# EAGLE design discharger (EAGLE 9.6.2)
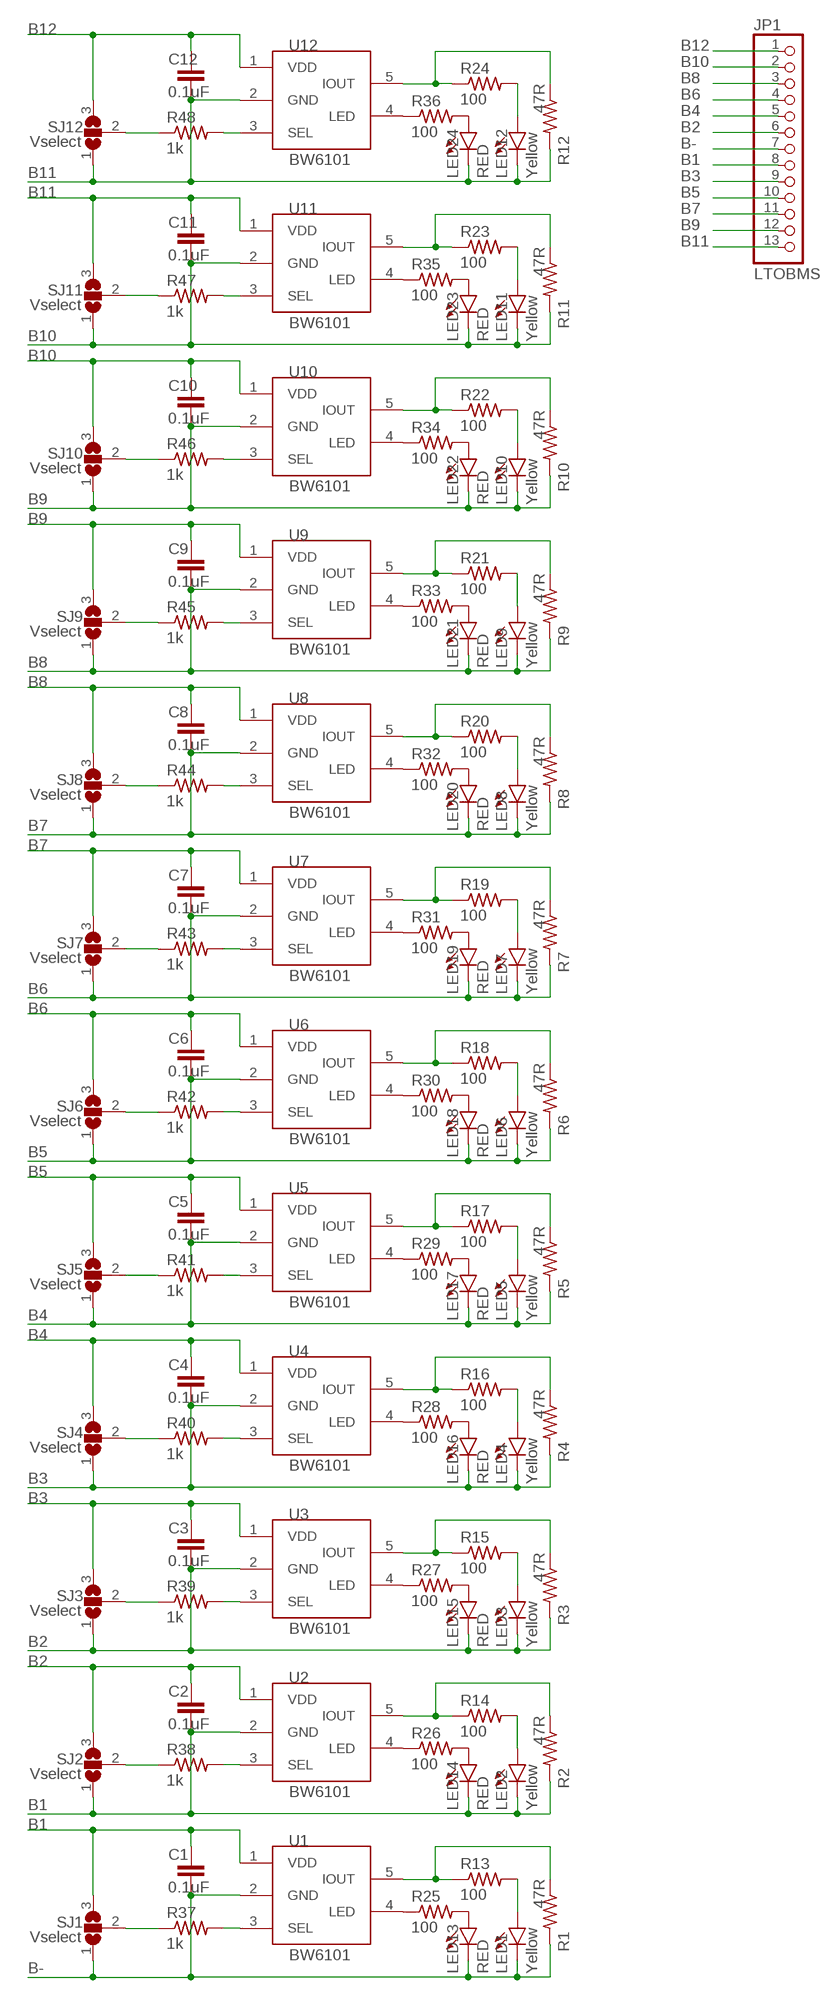
[diagram p0: schematic, sheet 1]

## Parts
C1  0.1uF  C-EUC0603  [C0603]
C2  0.1uF  C-EUC0603  [C0603]
C3  0.1uF  C-EUC0603  [C0603]
C4  0.1uF  C-EUC0603  [C0603]
C5  0.1uF  C-EUC0603  [C0603]
C6  0.1uF  C-EUC0603  [C0603]
C7  0.1uF  C-EUC0603  [C0603]
C8  0.1uF  C-EUC0603  [C0603]
C9  0.1uF  C-EUC0603  [C0603]
C10  0.1uF  C-EUC0603  [C0603]
C11  0.1uF  C-EUC0603  [C0603]
C12  0.1uF  C-EUC0603  [C0603]
JP1  LTOBMS  PINHD-1X13  [1X13]
LED1  Yellow  LED-YELLOW0603  [LED-0603]
LED2  Yellow  LED-YELLOW0603  [LED-0603]
LED3  Yellow  LED-YELLOW0603  [LED-0603]
LED4  Yellow  LED-YELLOW0603  [LED-0603]
LED5  Yellow  LED-YELLOW0603  [LED-0603]
LED6  Yellow  LED-YELLOW0603  [LED-0603]
LED7  Yellow  LED-YELLOW0603  [LED-0603]
LED8  Yellow  LED-YELLOW0603  [LED-0603]
LED9  Yellow  LED-YELLOW0603  [LED-0603]
LED10  Yellow  LED-YELLOW0603  [LED-0603]
LED11  Yellow  LED-YELLOW0603  [LED-0603]
LED12  Yellow  LED-YELLOW0603  [LED-0603]
LED13  RED  LED-RED0603  [LED-0603]
LED14  RED  LED-RED0603  [LED-0603]
LED15  RED  LED-RED0603  [LED-0603]
LED16  RED  LED-RED0603  [LED-0603]
LED17  RED  LED-RED0603  [LED-0603]
LED18  RED  LED-RED0603  [LED-0603]
LED19  RED  LED-RED0603  [LED-0603]
LED20  RED  LED-RED0603  [LED-0603]
LED21  RED  LED-RED0603  [LED-0603]
LED22  RED  LED-RED0603  [LED-0603]
LED23  RED  LED-RED0603  [LED-0603]
LED24  RED  LED-RED0603  [LED-0603]
R1  47R  R-US_R2512  [R2512]
R2  47R  R-US_R2512  [R2512]
R3  47R  R-US_R2512  [R2512]
R4  47R  R-US_R2512  [R2512]
R5  47R  R-US_R2512  [R2512]
R6  47R  R-US_R2512  [R2512]
R7  47R  R-US_R2512  [R2512]
R8  47R  R-US_R2512  [R2512]
R9  47R  R-US_R2512  [R2512]
R10  47R  R-US_R2512  [R2512]
R11  47R  R-US_R2512  [R2512]
R12  47R  R-US_R2512  [R2512]
R13  100  R-US_R0603  [R0603]
R14  100  R-US_R0603  [R0603]
R15  100  R-US_R0603  [R0603]
R16  100  R-US_R0603  [R0603]
R17  100  R-US_R0603  [R0603]
R18  100  R-US_R0603  [R0603]
R19  100  R-US_R0603  [R0603]
R20  100  R-US_R0603  [R0603]
R21  100  R-US_R0603  [R0603]
R22  100  R-US_R0603  [R0603]
R23  100  R-US_R0603  [R0603]
R24  100  R-US_R0603  [R0603]
R25  100  R-US_R0603  [R0603]
R26  100  R-US_R0603  [R0603]
R27  100  R-US_R0603  [R0603]
R28  100  R-US_R0603  [R0603]
R29  100  R-US_R0603  [R0603]
R30  100  R-US_R0603  [R0603]
R31  100  R-US_R0603  [R0603]
R32  100  R-US_R0603  [R0603]
R33  100  R-US_R0603  [R0603]
R34  100  R-US_R0603  [R0603]
R35  100  R-US_R0603  [R0603]
R36  100  R-US_R0603  [R0603]
R37  1k  R-US_R0603  [R0603]
R38  1k  R-US_R0603  [R0603]
R39  1k  R-US_R0603  [R0603]
R40  1k  R-US_R0603  [R0603]
R41  1k  R-US_R0603  [R0603]
R42  1k  R-US_R0603  [R0603]
R43  1k  R-US_R0603  [R0603]
R44  1k  R-US_R0603  [R0603]
R45  1k  R-US_R0603  [R0603]
R46  1k  R-US_R0603  [R0603]
R47  1k  R-US_R0603  [R0603]
R48  1k  R-US_R0603  [R0603]
SJ1  Vselect  SJ2W  [SJ_2]
SJ2  Vselect  SJ2W  [SJ_2]
SJ3  Vselect  SJ2W  [SJ_2]
SJ4  Vselect  SJ2W  [SJ_2]
SJ5  Vselect  SJ2W  [SJ_2]
SJ6  Vselect  SJ2W  [SJ_2]
SJ7  Vselect  SJ2W  [SJ_2]
SJ8  Vselect  SJ2W  [SJ_2]
SJ9  Vselect  SJ2W  [SJ_2]
SJ10  Vselect  SJ2W  [SJ_2]
SJ11  Vselect  SJ2W  [SJ_2]
SJ12  Vselect  SJ2W  [SJ_2]
U1  BW6101  [SOT23-5L]
U2  BW6101  [SOT23-5L]
U3  BW6101  [SOT23-5L]
U4  BW6101  [SOT23-5L]
U5  BW6101  [SOT23-5L]
U6  BW6101  [SOT23-5L]
U7  BW6101  [SOT23-5L]
U8  BW6101  [SOT23-5L]
U9  BW6101  [SOT23-5L]
U10  BW6101  [SOT23-5L]
U11  BW6101  [SOT23-5L]
U12  BW6101  [SOT23-5L]

## Nets
B1: C1.1 C2.2 JP1.8 LED2.C LED14.C R2.2 SJ1.3 SJ2.1 U1.1(VDD) U2.2(GND)
B2: C2.1 C3.2 JP1.6 LED3.C LED15.C R3.2 SJ2.3 SJ3.1 U2.1(VDD) U3.2(GND)
B3: C3.1 C4.2 JP1.9 LED4.C LED16.C R4.2 SJ3.3 SJ4.1 U3.1(VDD) U4.2(GND)
B4: C4.1 C5.2 JP1.5 LED5.C LED17.C R5.2 SJ4.3 SJ5.1 U4.1(VDD) U5.2(GND)
B5: C5.1 C6.2 JP1.10 LED6.C LED18.C R6.2 SJ5.3 SJ6.1 U5.1(VDD) U6.2(GND)
B6: C6.1 C7.2 JP1.4 LED7.C LED19.C R7.2 SJ6.3 SJ7.1 U6.1(VDD) U7.2(GND)
B7: C7.1 C8.2 JP1.11 LED8.C LED20.C R8.2 SJ7.3 SJ8.1 U7.1(VDD) U8.2(GND)
B8: C8.1 C9.2 JP1.3 LED9.C LED21.C R9.2 SJ8.3 SJ9.1 U8.1(VDD) U9.2(GND)
B9: C9.1 C10.2 JP1.12 LED10.C LED22.C R10.2 SJ9.3 SJ10.1 U9.1(VDD) U10.2(GND)
B10: C10.1 C11.2 JP1.2 LED11.C LED23.C R11.2 SJ10.3 SJ11.1 U10.1(VDD) U11.2(GND)
B11: C11.1 C12.2 JP1.13 LED12.C LED24.C R12.2 SJ11.3 SJ12.1 U11.1(VDD) U12.2(GND)
B12: C12.1 JP1.1 SJ12.3 U12.1(VDD)
B-: C1.2 JP1.7 LED1.C LED13.C R1.2 SJ1.1 U1.2(GND)
N$1: R1.1 R13.1 U1.5(IOUT)
N$2: LED1.A R13.2
N$3: R25.1 U1.4(LED)
N$4: LED2.A R14.2
N$5: LED7.A R19.2
N$6: R3.1 R15.1 U3.5(IOUT)
N$7: R37.1 SJ1.2
N$8: R38.1 SJ2.2
N$9: R27.1 U3.4(LED)
N$10: LED15.A R27.2
N$11: LED8.A R20.2
N$12: R39.1 SJ3.2
N$13: R40.1 SJ4.2
N$14: LED9.A R21.2
N$15: LED13.A R25.2
N$16: R8.1 R20.1 U8.5(IOUT)
N$17: R41.1 SJ5.2
N$18: R42.1 SJ6.2
N$19: R32.1 U8.4(LED)
N$20: LED20.A R32.2
N$21: R2.1 R14.1 U2.5(IOUT)
N$22: R43.1 SJ7.2
N$23: R44.1 SJ8.2
N$24: R26.1 U2.4(LED)
N$25: LED14.A R26.2
N$26: R4.1 R16.1 U4.5(IOUT)
N$27: R45.1 SJ9.2
N$28: R46.1 SJ10.2
N$29: R28.1 U4.4(LED)
N$30: LED16.A R28.2
N$31: LED10.A R22.2
N$32: LED11.A R23.2
N$33: LED12.A R24.2
N$34: LED6.A R18.2
N$35: LED5.A R17.2
N$36: R5.1 R17.1 U5.5(IOUT)
N$37: R47.1 SJ11.2
N$38: R48.1 SJ12.2
N$39: R29.1 U5.4(LED)
N$40: LED17.A R29.2
N$41: R9.1 R21.1 U9.5(IOUT)
N$42: R48.2 U12.3(SEL)
N$43: R47.2 U11.3(SEL)
N$44: R33.1 U9.4(LED)
N$45: LED21.A R33.2
N$46: R6.1 R18.1 U6.5(IOUT)
N$47: R46.2 U10.3(SEL)
N$48: R45.2 U9.3(SEL)
N$49: R30.1 U6.4(LED)
N$50: LED18.A R30.2
N$51: LED4.A R16.2
N$52: LED3.A R15.2
N$53: R44.2 U8.3(SEL)
N$54: R43.2 U7.3(SEL)
N$55: R42.2 U6.3(SEL)
N$56: R7.1 R19.1 U7.5(IOUT)
N$57: R41.2 U5.3(SEL)
N$58: R40.2 U4.3(SEL)
N$59: R31.1 U7.4(LED)
N$60: LED19.A R31.2
N$61: R10.1 R22.1 U10.5(IOUT)
N$62: R39.2 U3.3(SEL)
N$63: R38.2 U2.3(SEL)
N$64: R34.1 U10.4(LED)
N$65: LED22.A R34.2
N$66: R37.2 U1.3(SEL)
N$71: R11.1 R23.1 U11.5(IOUT)
N$74: R35.1 U11.4(LED)
N$75: LED23.A R35.2
N$81: R12.1 R24.1 U12.5(IOUT)
N$84: R36.1 U12.4(LED)
N$85: LED24.A R36.2

## Library data of the parts
C1-C12 = resistor:C-EU: CAPACITOR, European symbol; LCSCPART#: C49678
JP1 = pinhead:PINHD-1X13: PIN HEADER
LED1-LED12 = ltobms:LED-YELLOW: Yellow SMD LED Used in manufacturing several products at SparkFun. Packages: 0603 - SMD 0603 package[Product Link] <http://www.kingbrightusa.com/product.asp?catalog_name=LED&product_id=APT1608SYCK> 0603 -SMART - SMART SMD 0603 package (more efficient/more expensive) [Product Link] <http://www.osram-os.com/osram_os/en/products/product-catalog/led-light-emitting-diodes/smartled-0603/ly-l29k/index.jsp> LilyPad - SMD1206 package[Product Datasheet] <https://www.sparkfun.com/datasheets/DevTools/LilyPad/Q150YUS4.pdf> SparkFun Products: Blynk Board <https://www.sparkfun.com/products/13794> IOIO-OTG <https://www.sparkfun.com/products/13613> XBee Explorer Serial <https://www.sparkfun.com/products/13225>; LCSCPART#: C84256; PROD_ID: DIO-09003
LED13-LED24 = ltobms:LED-RED: Red SMD LED Used in manufacturing of most products at SparkFun Packages: 0603 - SMD 0603 package [Product Link] <http://docs.avagotech.com/docs/AV02-0551EN> 0603 SMART - SMD 0603 SMART package ( more efficient and expensive)[Product Link] <http://www.osram-os.com/Graphics/XPic2/00077099_0.pdf> 1206 - SMD1206 package [Product Link] <https://www.sparkfun.com/datasheets/DevTools/LilyPad/Q150OVS4.pdff> SparkFun Products: Pro Mini 328 -5V <https://www.sparkfun.com/products/821> RedBoard <https://www.sparkfun.com/products/12757> IOIO-OTG <https://www.sparkfun.com/products/13613>; LCSCPART#: C84256; PROD_ID: DIO-00819
R1-R12 = resistor:R-US_: RESISTOR, American symbol; LCSCPART#: C25384
R13-R36 = resistor:R-US_: RESISTOR, American symbol; LCSCPART#: C17408
R37-R48 = resistor:R-US_: RESISTOR, American symbol; LCSCPART#: C17513
SJ1-SJ12 = jumper:SJ2W: SMD solder JUMPER
U1-U12 = ltobms:BW6101: Super capacitor charging protection chip

## Net classes
0 default: width 0.305 mm, clearance 0.229 mm

## Board
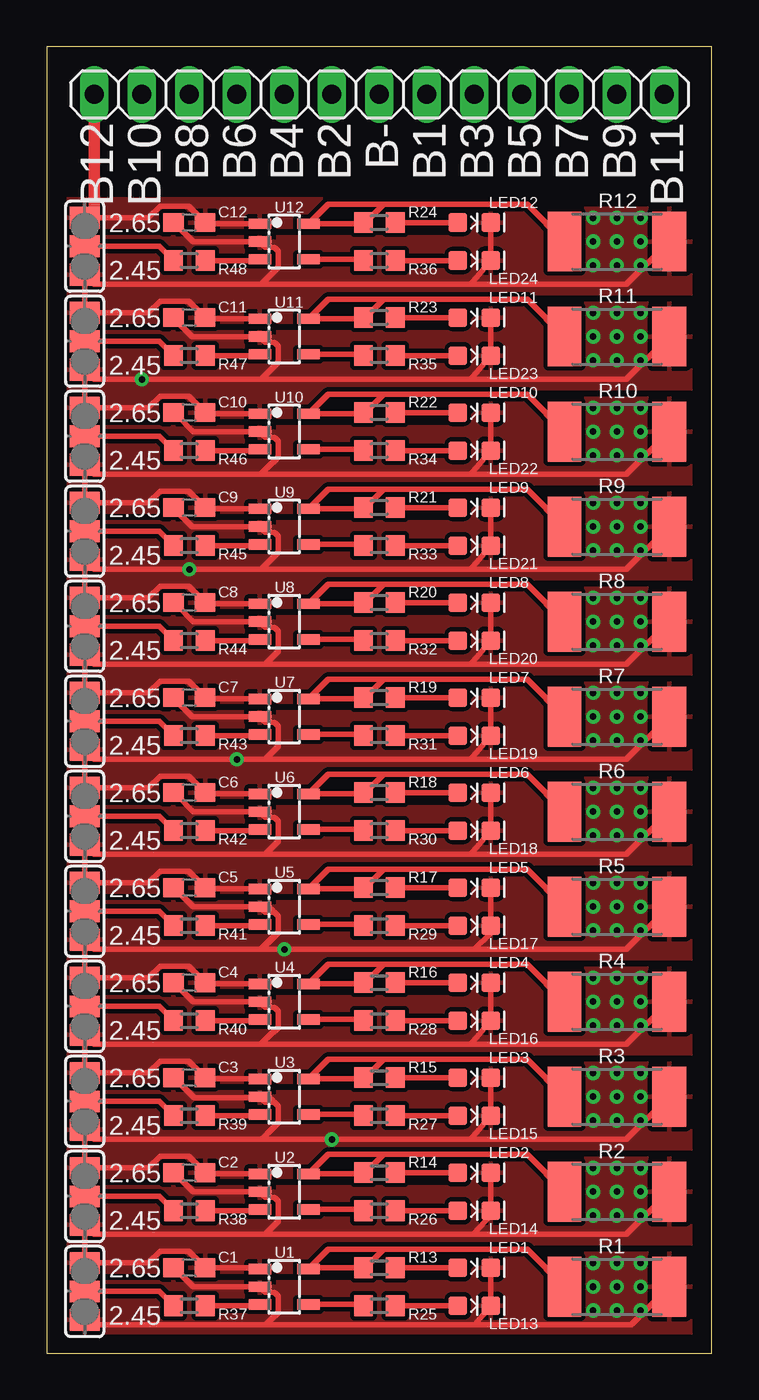
[diagram p1: board, top side]
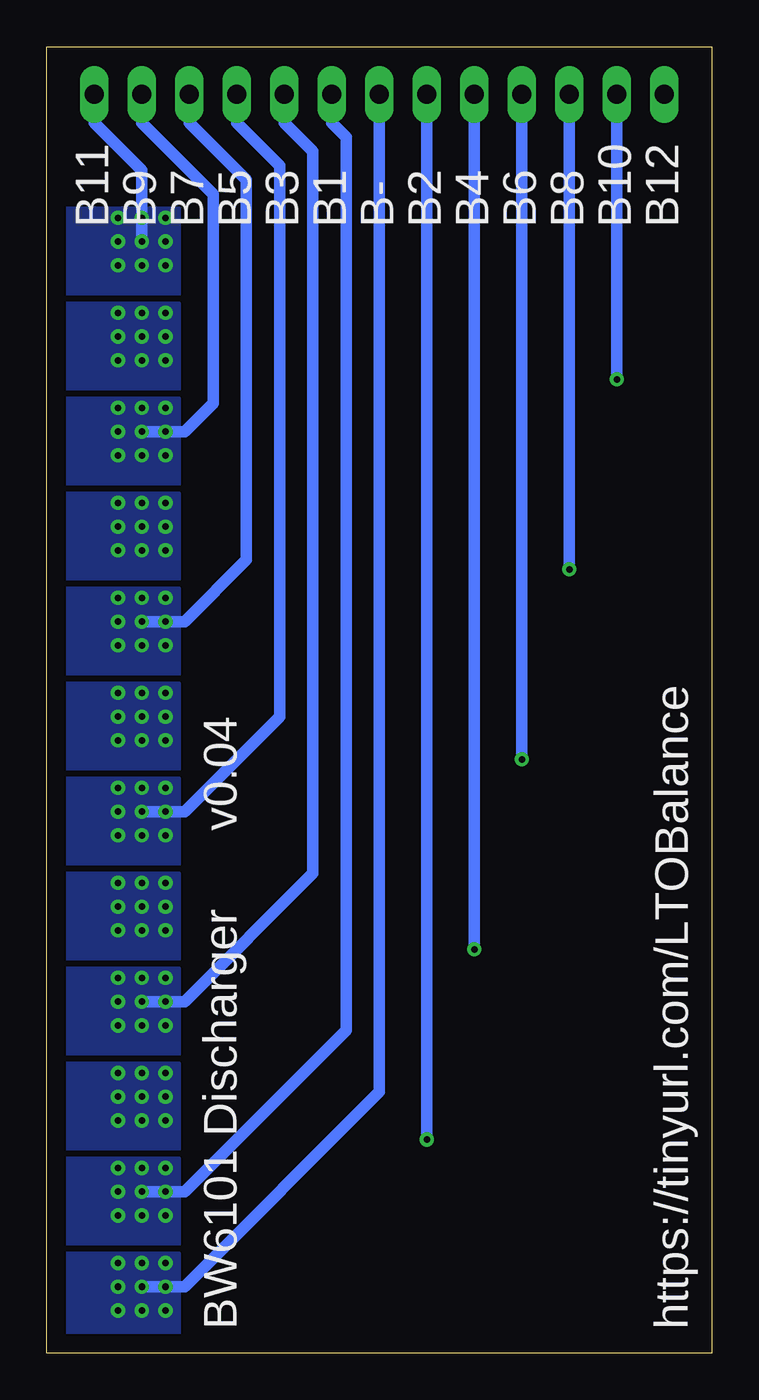
[diagram p2: board, bottom side, seen from below]

Size 35.56 x 69.85 mm. Coordinates in mm from the lower left corner, seen from the top.
Outline: 0,0 35.56,0 35.56,69.85 0,69.85 0,0
Copper layers (1*16): Top 0.035mm / dielectric 1.5mm / Bottom 0.035mm
Design rules "default *": minimum track width 6mil, minimum drill 0.35mm, track to track 6mil, track to pad 6mil, pad to pad 6mil, via to via 6mil, smd to smd 6mil, copper to edge 40mil, drill to drill 6mil, minimum pad ring 10mil, minimum via ring 8mil, stop-mask expansion 4mil, vias tented up to drill 14mil, thermal gap 10mil

### Footprints (pad centres in the part's own frame; a part is rotated, then mirrored left to right if it is on the bottom)
C0603 = smd 1.1 x 1: 1 -0.85,0; 2 0.85,0
1X13 = drill 1.016 long: 1 -15.24,0; 2 -12.7,0; 3 -10.16,0; 4 -7.62,0; 5 -5.08,0; 6 -2.54,0; 7 0,0; 8 2.54,0; 9 5.08,0; 10 7.62,0; 11 10.16,0; 12 12.7,0; 13 15.24,0
LED-0603 = smd 1 x 1: A -0.877,0; C 0.877,0
R2512 = smd 1.8 x 3.2: 1 -2.8,0; 2 2.8,0
R0603 = smd 1 x 1.1: 1 -0.85,0; 2 0.85,0
SJ_2 = smd 1.168 x 1.6: 1 -1.524,0; 2 0,0; 3 1.524,0
SOT23-5L = smd 0.55 x 1.2: 1 -0.95,-1.3; 2 0,-1.3; 3 0.95,-1.3; 4 0.95,1.3; 5 -0.95,1.3

### Placement (x,y rotation side)
C1  7.62,4.57 180 top
C2  7.62,9.65 180 top
C3  7.62,14.73 180 top
C4  7.62,19.81 180 top
C5  7.62,24.89 180 top
C6  7.62,29.97 180 top
C7  7.62,35.05 180 top
C8  7.62,40.13 180 top
C9  7.62,45.21 180 top
C10  7.62,50.29 180 top
C11  7.62,55.37 180 top
C12  7.62,60.45 180 top
JP1  17.78,67.31 0 top
LED1  22.86,4.57 0 top
LED2  22.86,9.65 0 top
LED3  22.86,14.73 0 top
LED4  22.86,19.81 0 top
LED5  22.86,24.89 0 top
LED6  22.86,29.97 0 top
LED7  22.86,35.05 0 top
LED8  22.86,40.13 0 top
LED9  22.86,45.21 0 top
LED10  22.86,50.29 0 top
LED11  22.86,55.37 0 top
LED12  22.86,60.45 0 top
LED13  22.86,2.54 0 top
LED14  22.86,7.62 0 top
LED15  22.86,12.7 0 top
LED16  22.86,17.78 0 top
LED17  22.86,22.86 0 top
LED18  22.86,27.94 0 top
LED19  22.86,33.02 0 top
LED20  22.86,38.1 0 top
LED21  22.86,43.18 0 top
LED22  22.86,48.26 0 top
LED23  22.86,53.34 0 top
LED24  22.86,58.42 0 top
R1  30.48,3.56 0 top
R2  30.48,8.64 0 top
R3  30.48,13.72 0 top
R4  30.48,18.8 0 top
R5  30.48,23.88 0 top
R6  30.48,28.96 0 top
R7  30.48,34.04 0 top
R8  30.48,39.12 0 top
R9  30.48,44.2 0 top
R10  30.48,49.28 0 top
R11  30.48,54.36 0 top
R12  30.48,59.44 0 top
R13  17.78,4.57 0 top
R14  17.78,9.65 0 top
R15  17.78,14.73 0 top
R16  17.78,19.81 0 top
R17  17.78,24.89 0 top
R18  17.78,29.97 0 top
R19  17.78,35.05 0 top
R20  17.78,40.13 0 top
R21  17.78,45.21 0 top
R22  17.78,50.29 0 top
R23  17.78,55.37 0 top
R24  17.78,60.45 0 top
R25  17.78,2.54 0 top
R26  17.78,7.62 0 top
R27  17.78,12.7 0 top
R28  17.78,17.78 0 top
R29  17.78,22.86 0 top
R30  17.78,27.94 0 top
R31  17.78,33.02 0 top
R32  17.78,38.1 0 top
R33  17.78,43.18 0 top
R34  17.78,48.26 0 top
R35  17.78,53.34 0 top
R36  17.78,58.42 0 top
R37  7.62,2.54 0 top
R38  7.62,7.62 0 top
R39  7.62,12.7 0 top
R40  7.62,17.78 0 top
R41  7.62,22.86 0 top
R42  7.62,27.94 0 top
R43  7.62,33.02 0 top
R44  7.62,38.1 0 top
R45  7.62,43.18 0 top
R46  7.62,48.26 0 top
R47  7.62,53.34 0 top
R48  7.62,58.42 0 top
SJ1  2.03,3.3 90 top
SJ2  2.03,8.38 90 top
SJ3  2.03,13.46 90 top
SJ4  2.03,18.54 90 top
SJ5  2.03,23.62 90 top
SJ6  2.03,28.7 90 top
SJ7  2.03,33.78 90 top
SJ8  2.03,38.86 90 top
SJ9  2.03,43.94 90 top
SJ10  2.03,49.02 90 top
SJ11  2.03,54.1 90 top
SJ12  2.03,59.18 90 top
U1  12.7,3.56 270 top
U2  12.7,8.64 270 top
U3  12.7,13.72 270 top
U4  12.7,18.8 270 top
U5  12.7,23.88 270 top
U6  12.7,28.96 270 top
U7  12.7,34.04 270 top
U8  12.7,39.12 270 top
U9  12.7,44.2 270 top
U10  12.7,49.28 270 top
U11  12.7,54.36 270 top
U12  12.7,59.44 270 top

### Tracks (layer width: path | path; a pad name or v marks a point on that pad's centre or on a via)
B1  (via drill 0.35)
  Top 0.305: LED2.C LED14.C 23.74,7.38 22.82,6.39 22.77,6.35 | 11.68,6.35 12.38,7.05 12.38,8.12 12.16,8.34 11.69,8.34 U2.2 7.84,8.64 6.82,9.65 C2.2 | 11.68,6.35 2.54,6.35 SJ2.1 SJ1.3 5.43,4.83 6.06,5.45 7.59,5.45 C1.1 11.33,4.57 U1.1 | R2.2 30.99,6.35 22.77,6.35 | 11.68,6.35 22.77,6.35
  Bottom 0.61: JP1.8 20.32,65.79 19.56,65.02 19.56,17.27 28.19,8.64 v30.48,8.64
  other vias: 30.48,9.91 29.21,9.91 31.75,9.91 31.75,7.37 30.48,7.37 29.21,7.37 31.75,8.64 29.21,8.64
  pour Top: 1.02,5.84 1.02,4.32 21.84,4.32 23.37,5.84
  pour Bottom: 28.45,10.41 34.8,10.41 34.8,5.84 28.45,5.84
  pour Top: 23.62,10.41 22.1,8.89 1.02,8.89 1.02,5.84 34.8,5.84 34.8,10.41
B2  (via drill 0.35)
  Top 0.305: LED3.C LED15.C 22.78,11.57 22.66,11.43 | 12.38,13.2 12.16,13.42 11.69,13.42 U3.2 | 12.38,13.2 12.38,12.33 | 12.38,12.33 11.73,11.68 | 11.48,11.43 v15.24,11.43 22.66,11.43 | R3.2 30.99,11.43 22.66,11.43 | U2.1 8.54,9.59 C2.1 7.59,10.53 6.06,10.53 5.43,9.91 SJ2.3 SJ3.1 2.54,11.43 11.48,11.43 | C3.2 6.89,14.66 7.89,13.66 11.92,13.66 12.38,13.2 | 12.38,13.2 12.38,12.33 | 12.38,12.33 11.73,11.68 | 11.73,11.68 11.48,11.43 | 11.73,11.68
  Bottom 0.61: JP1.6 v15.24,11.43
  other vias: 30.48,13.72 30.48,14.99 29.21,14.99 31.75,14.99 31.75,12.45 30.48,12.45 29.21,12.45 31.75,13.72 29.21,13.72
  pour Bottom: 28.45,15.49 34.8,15.49 34.8,10.92 28.45,10.92
  pour Top: 23.62,15.49 22.1,13.97 1.02,13.97 1.02,10.92 34.8,10.92 34.8,15.49
  pour Top: 1.02,10.92 1.02,9.4 21.84,9.4 23.37,10.92
B3  (via drill 0.35)
  Top 0.305: LED4.C LED16.C 22.78,16.65 22.66,16.51 | 11.43,16.51 12.11,17.19 12.16,17.19 12.38,17.41 12.38,18.28 12.16,18.5 11.69,18.5 U4.2 7.84,18.8 6.89,19.74 C4.2 | 11.43,16.51 2.54,16.51 SJ4.1 SJ3.3 5.43,14.99 6.06,15.61 7.59,15.61 C3.1 8.54,14.67 U3.1 | 22.66,16.51 11.43,16.51 | R4.2 30.99,16.51 22.66,16.51
  Bottom 0.61: JP1.9 22.86,65.79 21.34,64.26 21.34,25.65 28.19,18.8 v30.48,18.8
  other vias: 30.48,20.07 29.21,20.07 31.75,20.07 31.75,17.53 30.48,17.53 29.21,17.53 31.75,18.8 29.21,18.8
  pour Bottom: 28.45,20.57 34.8,20.57 34.8,16 28.45,16
  pour Top: 23.62,20.57 22.1,19.05 1.02,19.05 1.02,16 34.8,16 34.8,20.57
  pour Top: 1.02,16 1.02,14.48 21.84,14.48 23.37,16
B4  (via drill 0.35)
  Top 0.305: LED5.C LED17.C 23.74,22.47 22.86,21.59 | v12.7,21.59 2.54,21.59 SJ5.1 SJ4.3 5.43,20.07 6.06,20.69 7.59,20.69 C4.1 8.54,19.75 U4.1 | 12.38,23.36 12.16,23.58 11.69,23.58 U5.2 | 12.38,23.36 12.38,22.49 | 12.38,22.49 12.16,22.27 12.11,22.27 11.68,21.84 | 11.68,21.84 11.43,21.59 v12.7,21.59 | R5.2 30.99,21.59 22.86,21.59 | C5.2 6.89,24.82 7.84,23.88 11.86,23.88 12.38,23.36 | 12.38,23.36 12.38,22.49 | 12.38,22.49 11.73,21.84 11.68,21.84 | v12.7,21.59 22.86,21.59
  Bottom 0.61: JP1.5 v12.7,21.59
  other vias: 30.48,23.88 30.48,25.15 29.21,25.15 31.75,25.15 31.75,22.61 30.48,22.61 29.21,22.61 31.75,23.88 29.21,23.88
  pour Bottom: 28.45,25.65 34.8,25.65 34.8,21.08 28.45,21.08
  pour Top: 23.62,25.65 22.1,24.13 1.02,24.13 1.02,21.08 34.8,21.08 34.8,25.65
  pour Top: 1.02,21.08 1.02,19.56 21.84,19.56 23.37,21.08
B5  (via drill 0.35)
  Top 0.305: LED6.C LED18.C 22.78,26.81 22.66,26.67 | 11.68,26.67 12.38,27.37 12.38,28.44 12.16,28.66 11.69,28.66 U6.2 7.84,28.96 6.89,29.9 C6.2 | 11.68,26.67 2.54,26.67 SJ6.1 SJ5.3 5.43,25.15 6.06,25.77 7.59,25.77 C5.1 8.54,24.83 U5.1 | 22.66,26.67 11.68,26.67 | R6.2 30.99,26.67 22.66,26.67
  Bottom 0.61: v30.48,28.96 28.19,28.96 23.11,34.04 23.11,63.5 25.4,65.79 JP1.10
  other vias: 30.48,30.23 29.21,30.23 31.75,30.23 31.75,27.69 30.48,27.69 29.21,27.69 31.75,28.96 29.21,28.96
  pour Bottom: 28.45,30.73 34.8,30.73 34.8,26.16 28.45,26.16
  pour Top: 23.62,30.73 22.1,29.21 1.02,29.21 1.02,26.16 34.8,26.16 34.8,30.73
  pour Top: 1.02,26.16 1.02,24.64 21.84,24.64 23.37,26.16
B6  (via drill 0.35)
  Top 0.305: LED7.C LED19.C 22.78,31.89 22.66,31.75 | 11.68,31.75 12.38,32.45 12.38,33.52 12.16,33.74 11.69,33.74 U7.2 7.79,34.04 C7.2 | 22.66,31.75 11.68,31.75 | 11.68,31.75 v10.16,31.75 2.54,31.75 SJ7.1 SJ6.3 5.43,30.23 6.06,30.85 7.59,30.85 C6.1 8.54,29.91 U6.1 | R7.2 30.99,31.75 22.66,31.75
  Bottom 0.61: JP1.4 v10.16,31.75
  other vias: 30.48,34.04 30.48,35.31 29.21,35.31 31.75,35.31 31.75,32.77 30.48,32.77 29.21,32.77 31.75,34.04 29.21,34.04
  pour Bottom: 28.45,35.81 34.8,35.81 34.8,31.24 28.45,31.24
  pour Top: 23.62,35.81 22.1,34.29 1.02,34.29 1.02,31.24 34.8,31.24 34.8,35.81
  pour Top: 1.02,31.24 1.02,29.72 21.84,29.72 23.37,31.24
B7  (via drill 0.35)
  Top 0.305: LED8.C LED20.C 22.78,36.97 22.66,36.83 | 11.68,36.83 12.38,37.53 12.38,38.6 12.16,38.82 11.69,38.82 U8.2 7.84,39.12 6.89,40.06 C8.2 | 11.68,36.83 2.54,36.83 SJ8.1 SJ7.3 5.43,35.31 6.06,35.93 7.59,35.93 C7.1 8.54,34.99 U7.1 | 22.66,36.83 11.68,36.83 | R8.2 30.99,36.83 22.66,36.83
  Bottom 0.61: v30.48,39.12 28.19,39.12 24.89,42.42 24.89,62.74 27.94,65.79 JP1.11
  other vias: 30.48,40.39 29.21,40.39 31.75,40.39 31.75,37.85 30.48,37.85 29.21,37.85 31.75,39.12 29.21,39.12
  pour Bottom: 28.45,40.89 34.8,40.89 34.8,36.32 28.45,36.32
  pour Top: 23.62,40.89 22.1,39.37 1.02,39.37 1.02,36.32 34.8,36.32 34.8,40.89
  pour Top: 1.02,36.32 1.02,34.8 21.84,34.8 23.37,36.32
B8  (via drill 0.35)
  Top 0.305: LED9.C LED21.C 22.78,42.05 22.66,41.91 | 11.48,41.91 12.38,42.81 12.38,43.68 12.16,43.9 11.69,43.9 U9.2 7.79,44.2 C9.2 | 11.48,41.91 v7.62,41.91 2.54,41.91 SJ9.1 SJ8.3 5.43,40.39 6.06,41.01 7.59,41.01 C8.1 8.54,40.07 U8.1 | 22.66,41.91 11.48,41.91 | R9.2 30.99,41.91 22.66,41.91
  Bottom 0.61: JP1.3 v7.62,41.91
  other vias: 30.48,44.2 30.48,45.47 29.21,45.47 31.75,45.47 31.75,42.93 30.48,42.93 29.21,42.93 31.75,44.2 29.21,44.2
  pour Bottom: 28.45,45.97 34.8,45.97 34.8,41.4 28.45,41.4
  pour Top: 23.62,45.97 22.1,44.45 1.02,44.45 1.02,41.4 34.8,41.4 34.8,45.97
  pour Top: 1.02,41.4 1.02,39.88 21.84,39.88 23.37,41.4
B9  (via drill 0.35)
  Top 0.305: LED10.C LED22.C 22.78,47.13 22.66,46.99 | 11.43,46.99 12.11,47.67 12.16,47.67 12.38,47.89 12.38,48.76 12.16,48.98 11.69,48.98 U10.2 7.84,49.28 6.89,50.22 C10.2 | 11.43,46.99 2.54,46.99 SJ10.1 SJ9.3 5.43,45.47 6.06,46.09 7.59,46.09 C9.1 8.54,45.15 U9.1 | 22.66,46.99 11.43,46.99 | R10.2 30.99,46.99 22.66,46.99
  Bottom 0.61: v30.48,49.28 28.19,49.28 26.67,50.8 26.67,61.98 30.48,65.79 JP1.12
  other vias: 30.48,50.55 29.21,50.55 31.75,50.55 31.75,48.01 30.48,48.01 29.21,48.01 31.75,49.28 29.21,49.28
  pour Bottom: 28.45,51.05 34.8,51.05 34.8,46.48 28.45,46.48
  pour Top: 23.62,51.05 22.1,49.53 1.02,49.53 1.02,46.48 34.8,46.48 34.8,51.05
  pour Top: 1.02,46.48 1.02,44.96 21.84,44.96 23.37,46.48
B10  (via drill 0.35)
  Top 0.305: LED11.C LED23.C 22.78,52.21 22.66,52.07 | 11.48,52.07 v5.08,52.07 2.54,52.07 SJ11.1 SJ10.3 5.43,50.55 6.06,51.17 7.59,51.17 C10.1 8.54,50.23 U10.1 11.72,50.23 | 11.48,52.07 12.38,52.97 12.38,53.84 12.16,54.06 11.69,54.06 U11.2 7.79,54.36 C11.2 | 22.66,52.07 11.48,52.07 | R11.2 30.99,52.07 22.66,52.07
  Bottom 0.61: JP1.2 v5.08,52.07
  other vias: 30.48,54.36 30.48,55.63 29.21,55.63 31.75,55.63 31.75,53.09 30.48,53.09 29.21,53.09 31.75,54.36 29.21,54.36
  pour Bottom: 28.45,56.13 34.8,56.13 34.8,51.56 28.45,51.56
  pour Top: 23.62,56.13 22.1,54.61 1.02,54.61 1.02,51.56 34.8,51.56 34.8,56.13
  pour Top: 1.02,51.56 1.02,50.04 21.84,50.04 23.37,51.56
B11  (via drill 0.35)
  Top 0.305: LED12.C LED24.C 22.78,57.29 22.66,57.15 | 22.66,57.15 11.48,57.15 | 11.48,57.15 2.54,57.15 SJ12.1 SJ11.3 5.43,55.63 6.06,56.25 7.59,56.25 C11.1 8.54,55.31 U11.1 | R12.2 30.99,57.15 22.66,57.15 | C12.2 6.82,60.45 7.84,59.44 U12.2 11.69,59.14 12.16,59.14 12.38,58.92 12.38,58.05 11.48,57.15
  Bottom 0.61: v30.48,59.44 30.48,63.25 33.02,65.79 JP1.13
  other vias: 30.48,60.71 29.21,60.71 31.75,60.71 31.75,58.17 30.48,58.17 29.21,58.17 31.75,59.44 29.21,59.44
  pour Bottom: 28.45,61.21 34.8,61.21 34.8,56.64 28.45,56.64
  pour Top: 23.62,61.21 22.1,59.69 1.02,59.69 1.02,56.64 34.8,56.64 34.8,61.21
  pour Top: 1.02,56.64 1.02,55.12 21.84,55.12 23.37,56.64
B12
  Top 0.305: 2.54,61.21 SJ12.3 5.43,60.71 6.06,61.33 7.59,61.33 C12.1 8.54,60.39 U12.1
  Top 0.61: JP1.1 2.54,61.21
  pour Top: 1.02,61.72 1.02,60.2 21.84,60.2 23.37,61.72
B-  (via drill 0.35)
  Top 0.305: LED1.C LED13.C 22.88,1.52 | R1.2 31.25,1.52 22.88,1.52 | C1.2 6.89,4.5 7.84,3.56 U1.2 11.69,3.26 12.16,3.26 12.38,3.04 12.38,2.17 12.16,1.95 12.14,1.95 11.72,1.52 | 22.88,1.52 11.72,1.52 | 11.72,1.52 2.29,1.52 SJ1.1
  Bottom 0.61: JP1.7 17.78,13.97 28.19,3.56 v30.48,3.56
  other vias: 30.48,4.83 29.21,4.83 31.75,4.83 31.75,2.29 30.48,2.29 29.21,2.29 31.75,3.56 29.21,3.56
  pour Bottom: 28.45,5.33 34.8,5.33 34.8,1.02 28.45,1.02
  pour Top: 23.62,5.33 22.1,3.81 1.02,3.81 1.02,1.02 34.8,1.02 34.8,5.33
N$1
  Top 0.305: 18.02,5.55 17.04,4.57 R13.1 14.07,4.57 U1.5 15.05,5.55 18.02,5.55 | R1.1 25.68,5.55 18.02,5.55
N$2
  Top 0.305: R13.2 LED1.A
N$3
  Top 0.305: U1.4 16.76,2.61 R25.1
N$4
  Top 0.305: R14.2 LED2.A
N$5
  Top 0.305: R19.2 LED7.A
N$6
  Top 0.305: 18.02,15.71 17.04,14.73 R15.1 16.76,14.67 U3.5 15.05,15.71 18.02,15.71 | R3.1 25.68,15.71 18.02,15.71
N$7
  Top 0.305: SJ1.2 6.01,3.3 R37.1
N$8
  Top 0.305: SJ2.2 6.01,8.38 R38.1
N$9
  Top 0.305: U3.4 16.76,12.77 R27.1
N$10
  Top 0.305: R27.2 LED15.A
N$11
  Top 0.305: R20.2 LED8.A
N$12
  Top 0.305: SJ3.2 6.01,13.46 R39.1
N$13
  Top 0.305: SJ4.2 6.01,18.54 R40.1
N$14
  Top 0.305: R21.2 LED9.A
N$15
  Top 0.305: LED13.A R25.2
N$16
  Top 0.305: 18.02,41.11 17.04,40.13 R20.1 16.76,40.07 U8.5 15.05,41.11 18.02,41.11 | R8.1 25.68,41.11 18.02,41.11
N$17
  Top 0.305: SJ5.2 6.01,23.62 R41.1
N$18
  Top 0.305: SJ6.2 6.01,28.7 R42.1
N$19
  Top 0.305: U8.4 16.76,38.17 R32.1
N$20
  Top 0.305: R32.2 LED20.A
N$21
  Top 0.305: 18.02,10.63 17.04,9.65 R14.1 16.76,9.59 U2.5 15.05,10.63 18.02,10.63 | R2.1 25.68,10.63 18.02,10.63
N$22
  Top 0.305: SJ7.2 6.01,33.78 R43.1
N$23
  Top 0.305: SJ8.2 6.01,38.86 R44.1
N$24
  Top 0.305: U2.4 16.76,7.69 R26.1
N$25
  Top 0.305: LED14.A R26.2
N$26
  Top 0.305: 18.02,20.79 17.04,19.81 R16.1 16.76,19.75 U4.5 15.05,20.79 18.02,20.79 | R4.1 25.68,20.79 18.02,20.79
N$27
  Top 0.305: SJ9.2 6.01,43.94 R45.1
N$28
  Top 0.305: SJ10.2 6.01,49.02 R46.1
N$29
  Top 0.305: U4.4 16.76,17.85 R28.1
N$30
  Top 0.305: R28.2 LED16.A
N$31
  Top 0.305: R22.2 LED10.A
N$32
  Top 0.305: R23.2 LED11.A
N$33
  Top 0.305: R24.2 LED12.A
N$34
  Top 0.305: R18.2 LED6.A
N$35
  Top 0.305: R17.2 LED5.A
N$36
  Top 0.305: 18.02,25.87 17.04,24.89 R17.1 16.76,24.83 U5.5 15.05,25.87 18.02,25.87 | R5.1 25.68,25.87 18.02,25.87
N$37
  Top 0.305: SJ11.2 6.01,54.1 R47.1
N$38
  Top 0.305: SJ12.2 6.01,59.18 R48.1
N$39
  Top 0.305: U5.4 16.76,22.93 R29.1
N$40
  Top 0.305: R29.2 LED17.A
N$41
  Top 0.305: 18.02,46.19 17.04,45.21 R21.1 16.76,45.15 U9.5 15.05,46.19 18.02,46.19 | R9.1 25.68,46.19 18.02,46.19
N$42
  Top 0.305: R48.2 11.33,58.42 U12.3
N$43
  Top 0.305: R47.2 11.33,53.34 U11.3
N$44
  Top 0.305: U9.4 16.76,43.25 R33.1
N$45
  Top 0.305: R33.2 LED21.A
N$46
  Top 0.305: 18.02,30.95 17.04,29.97 R18.1 16.76,29.91 U6.5 15.05,30.95 18.02,30.95 | R6.1 25.68,30.95 18.02,30.95
N$47
  Top 0.305: R46.2 10.92,48.26 U10.3
N$48
  Top 0.305: R45.2 10.92,43.18 U9.3
N$49
  Top 0.305: U6.4 16.76,28.01 R30.1
N$50
  Top 0.305: R30.2 LED18.A
N$51
  Top 0.305: R16.2 LED4.A
N$52
  Top 0.305: R15.2 LED3.A
N$53
  Top 0.305: R44.2 10.92,38.1 U8.3
N$54
  Top 0.305: R43.2 10.92,33.02 U7.3
N$55
  Top 0.305: R42.2 10.92,27.94 U6.3
N$56
  Top 0.305: 18.02,36.03 17.04,35.05 R19.1 16.76,34.99 U7.5 15.05,36.03 18.02,36.03 | R7.1 25.68,36.03 18.02,36.03
N$57
  Top 0.305: R41.2 10.92,22.86 U5.3
N$58
  Top 0.305: R40.2 10.92,17.78 U4.3
N$59
  Top 0.305: U7.4 16.76,33.09 R31.1
N$60
  Top 0.305: R31.2 LED19.A
N$61
  Top 0.305: 18.02,51.27 17.04,50.29 R22.1 16.76,50.23 U10.5 15.05,51.27 18.02,51.27 | R10.1 25.68,51.27 18.02,51.27
N$62
  Top 0.305: R39.2 10.92,12.7 U3.3
N$63
  Top 0.305: R38.2 10.92,7.62 U2.3
N$64
  Top 0.305: U10.4 16.76,48.33 R34.1
N$65
  Top 0.305: R34.2 LED22.A
N$66
  Top 0.305: R37.2 10.92,2.54 U1.3
N$67
  Top 0.305: 2.03,59.18 2.03,57.66
N$68
  Top 0.305: 2.03,54.1 2.03,52.58
N$69
  Top 0.305: 2.03,49.02 2.03,47.5
N$70
  Top 0.305: 2.03,43.94 2.03,42.42
N$71
  Top 0.305: 18.02,56.35 17.04,55.37 R23.1 16.76,55.31 U11.5 15.05,56.35 18.02,56.35 | R11.1 25.68,56.35 18.02,56.35
N$72
  Top 0.305: 2.03,38.86 2.03,37.34
N$73
  Top 0.305: 2.03,33.78 2.03,32.26
N$74
  Top 0.305: U11.4 16.76,53.41 R35.1
N$75
  Top 0.305: R35.2 LED23.A
N$76
  Top 0.305: 2.03,28.7 2.03,27.18
N$77
  Top 0.305: 2.03,23.62 2.03,22.1
N$78
  Top 0.305: 2.03,18.54 2.03,17.02
N$79
  Top 0.305: 2.03,13.46 2.03,11.94
N$80
  Top 0.305: 2.03,8.38 2.03,6.86
N$81
  Top 0.305: 18.02,61.43 17.04,60.45 R24.1 16.76,60.39 U12.5 15.05,61.43 18.02,61.43 | R12.1 25.68,61.43 18.02,61.43
N$82
  Top 0.305: 2.03,3.3 2.03,1.78
N$84
  Top 0.305: U12.4 16.76,58.49 R36.1
N$85
  Top 0.305: R36.2 LED24.A

### Text on the board
tNames: B12 | B10 | B8 | B6 | B4 | B2 | B- | B1 | B3 | B5 | B7 | B9 | B11 | 2.65 | 2.45 | 2.65 | 2.45 | 2.65 | 2.45 | 2.65 | 2.45 | 2.65 | 2.45 | 2.65 | 2.45 | 2.65 | 2.45 | 2.65 | 2.45 | 2.65 | 2.45 | 2.65 | 2.45 | 2.65 | 2.45 | 2.65 | 2.45
bNames: B12 | B10 | B8 | B6 | B4 | B2 | B- | B1 | B3 | B5 | B7 | B9 | B11 | https://tinyurl.com/LTOBalance | BW6101 Discharger